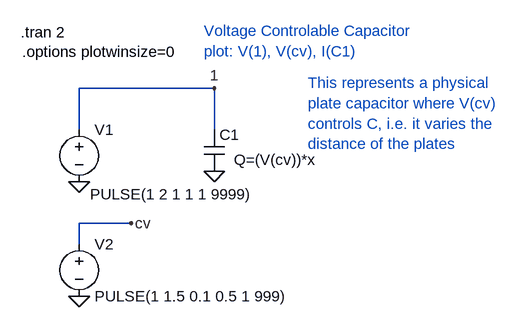
[diagram p0: schematic controlled_capacitor.asc]
controlled_capacitor.asc, the LTspice schematic file:
Version 4
SHEET 1 880 680
WIRE 48 144 -160 144
WIRE -160 208 -160 144
WIRE 48 208 48 144
WIRE -80 352 -160 352
WIRE -160 384 -160 352
FLAG -160 288 0
FLAG 48 272 0
FLAG 48 144 1
FLAG -160 464 0
FLAG -80 352 cv
SYMBOL cap 32 208 R0
WINDOW 3 46 46 Left 0
SYMATTR Value Q=(V(cv))*x
SYMATTR InstName C1
SYMBOL voltage -160 192 R0
WINDOW 123 0 0 Left 0
WINDOW 39 0 0 Left 0
WINDOW 3 17 115 Left 0
SYMATTR Value PULSE(1 2 1 1 1 9999)
SYMATTR InstName V1
SYMBOL voltage -160 368 R0
WINDOW 123 0 0 Left 0
WINDOW 39 0 0 Left 0
SYMATTR InstName V2
SYMATTR Value PULSE(1 1.5 0.1 0.5 1 999)
TEXT -250 58 Left 0 !.tran 2
TEXT -248 88 Left 0 !.options plotwinsize=0
TEXT 32 56 Left 0 ;Voltage Controlable Capacitor\nplot: V(1), V(cv), I(C1)
TEXT 192 136 Left 0 ;This represents a physical\nplate capacitor where V(cv)\ncontrols C, i.e. it varies the\ndistance of the plates

The netlist it stands for:
* controlled_capacitor.asc
C1 1 0 Q=(V(cv))*x
V1 1 0 PULSE(1 2 1 1 1 9999)
V2 cv 0 PULSE(1 1.5 0.1 0.5 1 999)
.tran 2
.options plotwinsize=0
* Voltage Controlable Capacitor
* plot: V(1), V(cv), I(C1)
* This represents a physical
* plate capacitor where V(cv)
* controls C, i.e. it varies the
* distance of the plates
.backanno
.end